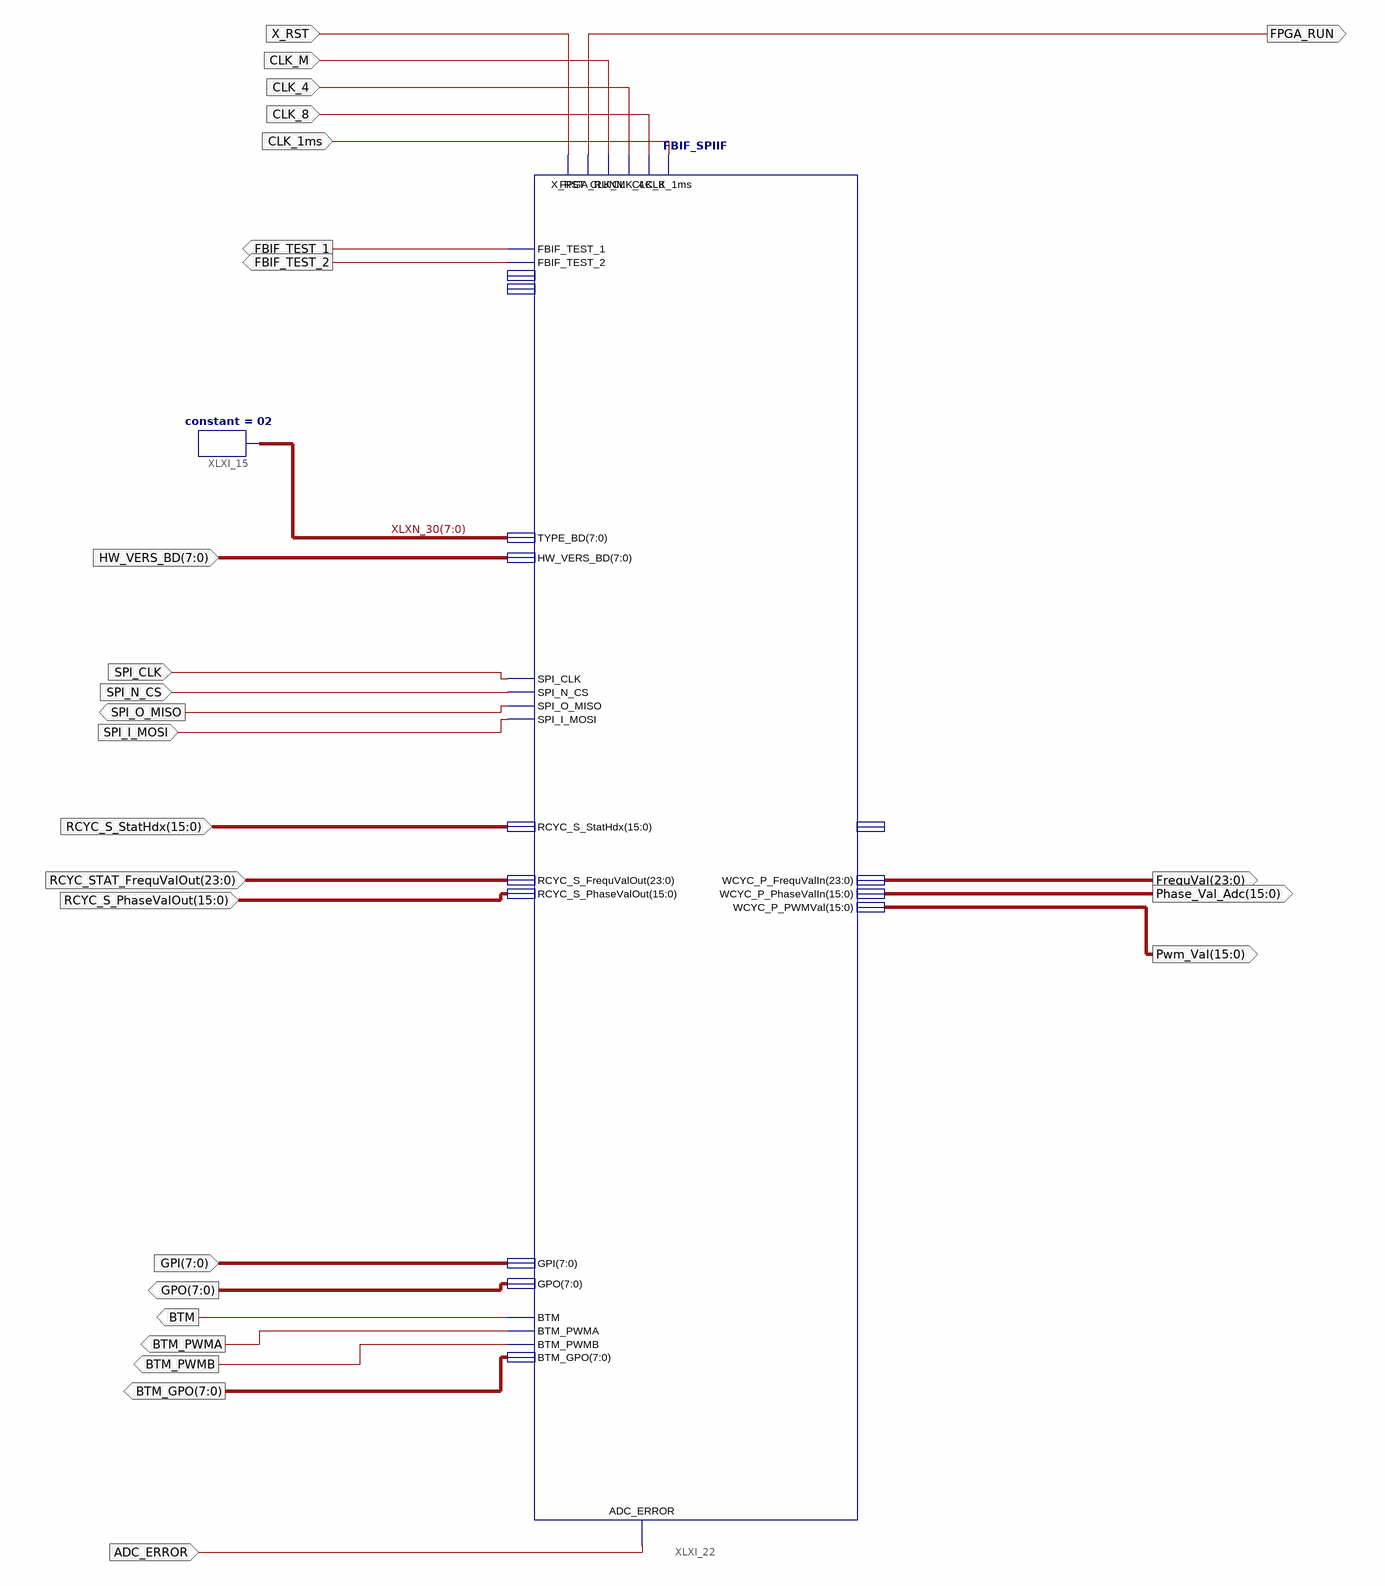
[diagram p0: schematic sheet 1]
// Xilinx ISE schematic uP_SPI_IF.sch (spartan3a) as structural Verilog: 2 symbols, 26 ports
module uP_SPI_IF (
  input  X_RST,
  input  CLK_M,
  input  CLK_8,
  input  CLK_4,
  input  CLK_1ms,
  input  [7:0] HW_VERS_BD,
  input  SPI_CLK,
  input  SPI_N_CS,
  input  SPI_I_MOSI,
  input  [15:0] RCYC_S_StatHdx,
  input  [23:0] RCYC_STAT_FrequValOut,
  input  [15:0] RCYC_S_PhaseValOut,
  input  [7:0] GPI,
  input  ADC_ERROR,
  output FBIF_TEST_1,
  output FBIF_TEST_2,
  output SPI_O_MISO,
  output [7:0] GPO,
  output BTM,
  output BTM_PWMA,
  output [7:0] BTM_GPO,
  output BTM_PWMB,
  output [23:0] FrequVal,
  output [15:0] Phase_Val_Adc,
  output [15:0] Pwm_Val,
  output FPGA_RUN
);

  wire [7:0] XLXN_30;

  constant #(.CValue("02")) XLXI_15 (.O(XLXN_30));
  FBIF_SPIIF XLXI_22 (
    .ADC_ERROR(ADC_ERROR), .CLK_1ms(CLK_1ms), .CLK_4(CLK_4), .CLK_8(CLK_8), .CLK_M(CLK_M), .GPI(GPI),
    .HW_VERS_BD(HW_VERS_BD), .RCYC_S_FrequValOut(RCYC_STAT_FrequValOut),
    .RCYC_S_PhaseValOut(RCYC_S_PhaseValOut), .RCYC_S_StatHdx(RCYC_S_StatHdx), .SPI_CLK(SPI_CLK),
    .SPI_I_MOSI(SPI_I_MOSI), .SPI_N_CS(SPI_N_CS), .TYPE_BD(XLXN_30), .X_RST(X_RST), .BTM(BTM),
    .BTM_GPO(BTM_GPO), .BTM_PWMA(BTM_PWMA), .BTM_PWMB(BTM_PWMB), .FBIF_TEST_1(FBIF_TEST_1),
    .FBIF_TEST_2(FBIF_TEST_2), .FPGA_RUN(FPGA_RUN), .GPO(GPO), .SPI_O_MISO(SPI_O_MISO),
    .WCYC_P_FrequValIn(FrequVal), .WCYC_P_PhaseValIn(Phase_Val_Adc), .WCYC_P_PWMVal(Pwm_Val));  // open: FPGA_CTRL_TEST, FPGA_STAT_TEST, WCYC_P_CtrlHdx
endmodule
